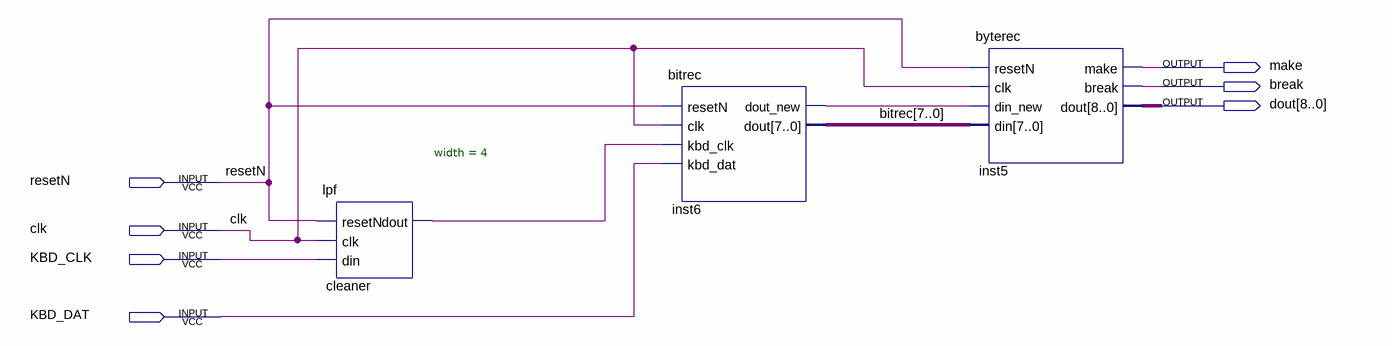
[diagram p0: schematic sheet]
// Quartus schematic KBD.bdf as structural Verilog: 3 symbols, 7 pins
module KBD (
  input  resetN,
  input  clk,
  input  KBD_CLK,
  input  KBD_DAT,
  output make,
  output \break ,
  output [8:0] dout
);

  wire cleaner_dout, inst6_dout_new;
  wire [7:0] bitrec;

  lpf #(.width(4)) cleaner (.resetN(resetN), .clk(clk), .din(KBD_CLK), .dout(cleaner_dout));
  bitrec inst6 (
    .resetN(resetN), .clk(clk), .kbd_clk(cleaner_dout), .kbd_dat(KBD_DAT), .dout_new(inst6_dout_new),
    .dout(bitrec));
  byterec inst5 (
    .resetN(resetN), .clk(clk), .din_new(inst6_dout_new), .din(bitrec), .make(make), .\break (\break ),
    .dout(dout));
endmodule
